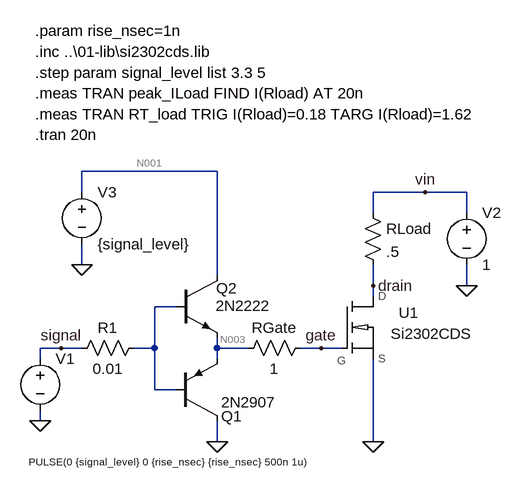
[diagram p0: schematic 02-si2302cds_fast_switching.asc]
02-si2302cds_fast_switching.asc, the LTspice schematic file:
Version 4
SHEET 1 880 680
WIRE 96 -112 -112 -112
WIRE -112 -80 -112 -112
WIRE 416 -80 336 -80
WIRE 480 -80 416 -80
WIRE 336 -48 336 -80
WIRE 480 -48 480 -80
WIRE -112 32 -112 0
WIRE 96 48 96 -112
WIRE 336 64 336 32
WIRE 480 64 480 32
WIRE 336 80 336 64
WIRE 32 96 0 96
WIRE -144 160 -176 160
WIRE -112 160 -144 160
WIRE 0 160 0 96
WIRE 0 160 -32 160
WIRE 96 160 96 144
WIRE 144 160 96 160
WIRE 256 160 224 160
WIRE 288 160 256 160
WIRE -176 176 -176 160
WIRE 96 176 96 160
WIRE 0 224 0 160
WIRE 32 224 0 224
WIRE -176 272 -176 256
WIRE 96 304 96 272
WIRE 336 304 336 176
FLAG 336 304 0
FLAG -176 272 0
FLAG 480 64 0
FLAG 416 -80 vin
FLAG 336 64 drain
FLAG 256 160 gate
FLAG -144 160 signal
FLAG -112 32 0
FLAG 96 304 0
SYMBOL res 240 144 R90
WINDOW 0 0 56 VBottom 2
WINDOW 3 32 56 VTop 2
SYMATTR InstName RGate
SYMATTR Value 1
SYMBOL voltage -176 160 R0
WINDOW 3 -18 175 Left 1
WINDOW 123 0 0 Left 0
WINDOW 39 0 0 Left 0
SYMATTR Value PULSE(0 {signal_level} 0 {rise_nsec} {rise_nsec} 500n 1u)
SYMATTR InstName V1
SYMBOL res 320 -64 R0
SYMATTR InstName RLoad
SYMATTR Value .5
SYMBOL voltage 480 -64 R0
WINDOW 123 0 0 Left 0
WINDOW 39 0 0 Left 0
SYMATTR InstName V2
SYMATTR Value 1
SYMBOL Si2302CDS 288 80 R0
SYMATTR InstName U1
SYMBOL pnp 32 272 M180
WINDOW 0 70 7 Left 2
WINDOW 3 70 29 Left 2
SYMATTR InstName Q1
SYMATTR Value 2N2907
SYMBOL npn 32 48 R0
WINDOW 0 63 20 Left 2
WINDOW 3 62 47 Left 2
SYMATTR InstName Q2
SYMATTR Value 2N2222
SYMBOL voltage -112 -96 R0
WINDOW 123 0 0 Left 0
WINDOW 39 0 0 Left 0
SYMATTR InstName V3
SYMATTR Value {signal_level}
SYMBOL res -16 144 R90
WINDOW 0 0 56 VBottom 2
WINDOW 3 32 56 VTop 2
SYMATTR InstName R1
SYMATTR Value 0.01
TEXT -184 -168 Left 2 !.tran 20n
TEXT -184 -296 Left 2 !.inc ..\\01-lib\\si2302cds.lib
TEXT -184 -328 Left 2 !.param rise_nsec=1n
TEXT -184 -264 Left 2 !.step param signal_level list 3.3 5
TEXT -184 -232 Left 2 !.meas TRAN peak_ILoad FIND I(Rload) AT 20n
TEXT -184 -200 Left 2 !.meas TRAN RT_load TRIG I(Rload)=0.18 TARG I(Rload)=1.62

The netlist it stands for:
* 02-si2302cds_fast_switching.asc
RGate gate N003 1
V1 signal 0 PULSE(0 {signal_level} 0 {rise_nsec} {rise_nsec} 500n 1u)
RLoad vin drain .5
V2 vin 0 1
XU1 drain gate 0 Si2302CDS  ; pins D G S
Q1 0 N002 N003 0 2N2907
Q2 N001 N002 N003 0 2N2222
V3 N001 0 {signal_level}
R1 N002 signal 0.01
.model NPN NPN
.model PNP PNP
.lib standard.bjt
.tran 20n
.inc ..\01-lib\si2302cds.lib
.param rise_nsec=1n
.step param signal_level list 3.3 5
.meas TRAN peak_ILoad FIND I(Rload) AT 20n
.meas TRAN RT_load TRIG I(Rload)=0.18 TARG I(Rload)=1.62
.lib si2302cds.lib
.backanno
.end

* Results of the author's LTspice run, read from the files saved beside the schematic
* Operating Point (first step), zero values left out:
*   signal_level = 3.3 
*   V(gate) = 3.7 mV
*   V(n003) = 3.7 mV
*   V(vin) = 1 V
*   V(drain) = 1 V
*   V(n001) = 3.3 V
*   Ic(Q2) = 3.311 pA
*   Ib(Q2) = -3.307 pA
*   I(Rload) = 33.08 nA
*   I(R1) = 3.311 pA
*   I(V1) = 3.311 pA
*   I(V2) = -33.08 nA
*   I(V3) = -3.311 pA
*   Ix(u1:D) = 33.08 nA
*   Ix(u1:S) = -33.08 nA
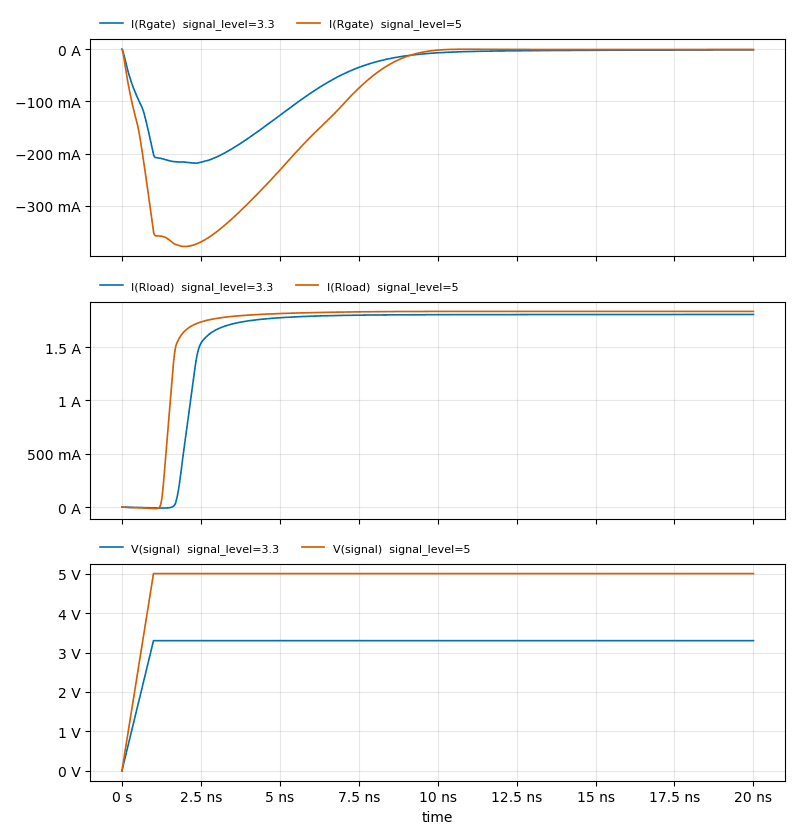
[diagram p1: Transient Analysis of 02-si2302cds_fast_switching.asc, plotted from the saved traces]
* Transient Analysis, 2 runs:
*   I(Rgate) [signal_level=3.3]: min -218.2 mA, max 0 A, average -55.87 mA, rms 94.55 mA, last -1.219 mA
*   I(Rgate) [signal_level=5]: min -377.8 mA, max 0 A, average -96.65 mA, rms 165.1 mA, last -465.3 µA
*   I(Rload) [signal_level=3.3]: min -8.704 mA, max 1.806 A, average 1.598 A, rms 1.685 A, last 1.806 A
*   I(Rload) [signal_level=5]: min -14.45 mA, max 1.834 A, average 1.682 A, rms 1.746 A, last 1.834 A
*   V(signal) [signal_level=3.3]: min 0 V, max 3.3 V, average 3.217 V, rms 3.245 V, last 3.3 V
*   V(signal) [signal_level=5]: min 0 V, max 5 V, average 4.875 V, rms 4.916 V, last 5 V
* From the log:
*   Measurement: peak_iload
*     step  i(rload)  at
*        1  1.80563  2e-08
*        2  1.83435  2e-08
*   Measurement: rt_load
*     step  rt_load  FROM  TO
*        1  9.60802e-10  1.80064e-09  2.76144e-09
*        2  5.95215e-10  1.302e-09  1.89722e-09